# EAGLE design CubeShield (EAGLE 8.2.1)
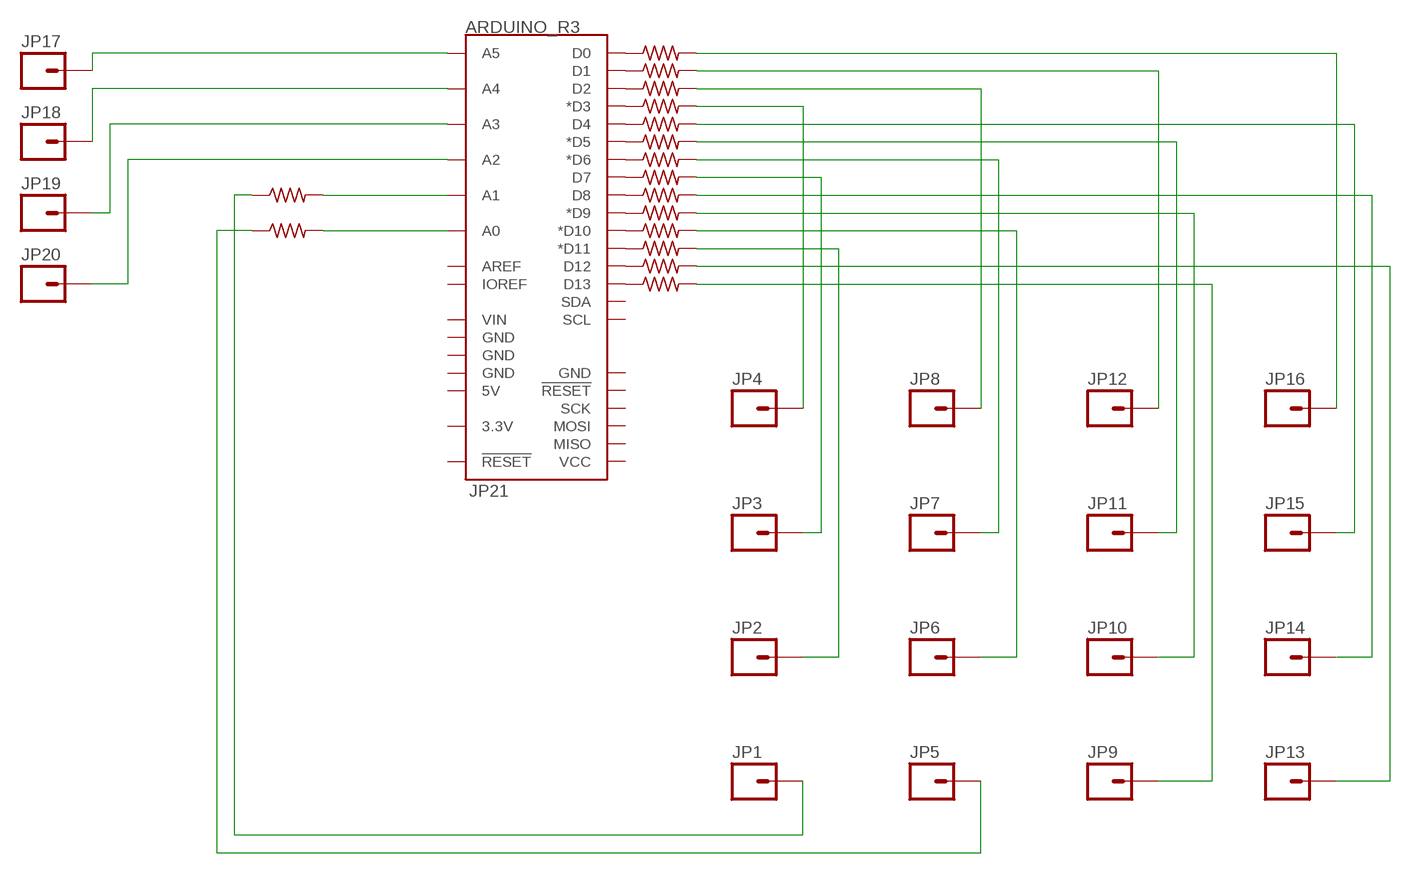
[diagram p0: schematic, sheet 1]

## Parts
JP1  M01PTH_LONGPAD  [1X01_LONGPAD]
JP2  M01PTH_LONGPAD  [1X01_LONGPAD]
JP3  M01PTH_LONGPAD  [1X01_LONGPAD]
JP4  M01PTH_LONGPAD  [1X01_LONGPAD]
JP5  M01PTH_LONGPAD  [1X01_LONGPAD]
JP6  M01PTH_LONGPAD  [1X01_LONGPAD]
JP7  M01PTH_LONGPAD  [1X01_LONGPAD]
JP8  M01PTH_LONGPAD  [1X01_LONGPAD]
JP9  M01PTH_LONGPAD  [1X01_LONGPAD]
JP10  M01PTH_LONGPAD  [1X01_LONGPAD]
JP11  M01PTH_LONGPAD  [1X01_LONGPAD]
JP12  M01PTH_LONGPAD  [1X01_LONGPAD]
JP13  M01PTH_LONGPAD  [1X01_LONGPAD]
JP14  M01PTH_LONGPAD  [1X01_LONGPAD]
JP15  M01PTH_LONGPAD  [1X01_LONGPAD]
JP16  M01PTH_LONGPAD  [1X01_LONGPAD]
JP17  M01PTH_LONGPAD  [1X01_LONGPAD]
JP18  M01PTH_LONGPAD  [1X01_LONGPAD]
JP19  M01PTH_LONGPAD  [1X01_LONGPAD]
JP20  M01PTH_LONGPAD  [1X01_LONGPAD]
JP21  ARDUINO_R3  [ARDUINO_R3]
R1  R-US_0207/7  [0207/7]
R2  R-US_0207/7  [0207/7]
R3  R-US_0207/7  [0207/7]
R4  R-US_0207/7  [0207/7]
R5  R-US_0207/7  [0207/7]
R6  R-US_0207/7  [0207/7]
R7  R-US_0207/7  [0207/7]
R8  R-US_0207/7  [0207/7]
R9  R-US_0207/7  [0207/7]
R10  R-US_0207/7  [0207/7]
R11  R-US_0207/7  [0207/7]
R12  R-US_0207/7  [0207/7]
R13  R-US_0207/7  [0207/7]
R14  R-US_0207/7  [0207/7]
R15  R-US_0207/7  [0207/7]
R16  R-US_0207/7  [0207/7]

## Nets
N$1: JP21.D0 R1.1
N$2: JP21.D1 R2.1
N$3: JP21.D2 R3.1
N$4: JP21.D3(*D3) R4.1
N$5: JP21.D4 R5.1
N$6: JP21.D5(*D5) R6.1
N$7: JP21.D6(*D6) R7.1
N$8: JP21.D7 R8.1
N$9: JP21.D8 R9.1
N$10: JP21.D9(*D9) R10.1
N$11: JP21.D10(*D10) R11.1
N$12: JP21.D11(*D11) R12.1
N$13: JP21.D12 R13.1
N$14: JP21.D13 R14.1
N$15: JP16.1 R1.2
N$16: JP12.1 R2.2
N$17: JP8.1 R3.2
N$18: JP4.1 R4.2
N$19: JP15.1 R5.2
N$20: JP11.1 R6.2
N$21: JP7.1 R7.2
N$22: JP3.1 R8.2
N$23: JP14.1 R9.2
N$24: JP10.1 R10.2
N$25: JP6.1 R11.2
N$26: JP2.1 R12.2
N$27: JP21.A0 R15.2
N$28: JP21.A1 R16.2
N$29: JP13.1 R13.2
N$30: JP9.1 R14.2
N$31: JP5.1 R15.1
N$32: JP1.1 R16.1
N$33: JP17.1 JP21.A5
N$34: JP18.1 JP21.A4
N$35: JP19.1 JP21.A3
N$36: JP20.1 JP21.A2
Unconnected: JP21.3.3V JP21.5V JP21.AREF JP21.GND@1(GND) JP21.GND@2(GND) JP21.GND@3(GND) JP21.GND@4(GND) JP21.IOREF JP21.MISO JP21.MOSI JP21.RESET@1(!RESET!) JP21.RESET@2(!RESET!) JP21.SCK JP21.SCL JP21.SDA JP21.VCC JP21.VIN

## Library data of the parts
JP1-JP20 = SparkFun-Connectors:M01: Header 1 Standard 1-pin 0.1" header. Use with straight break away headers (SKU : PRT-00116), right angle break away headers (PRT-00553), swiss pins (PRT-00743), machine pins (PRT-00117), and female headers (PRT-00115). SMTSO-256-ET is a "flush mount" nut for a 4-40 screw. The older package used to be too tight, and did not allow it to sit properly thru the drill hit. The latest (0.165DIA) fits nice and snug.
JP21 = SparkFun-Boards:ARDUINO_R3: Arduino R3 Footprint (w/ SPI header)
R1-R16 = rcl:R-US_: RESISTOR, American symbol

## Board
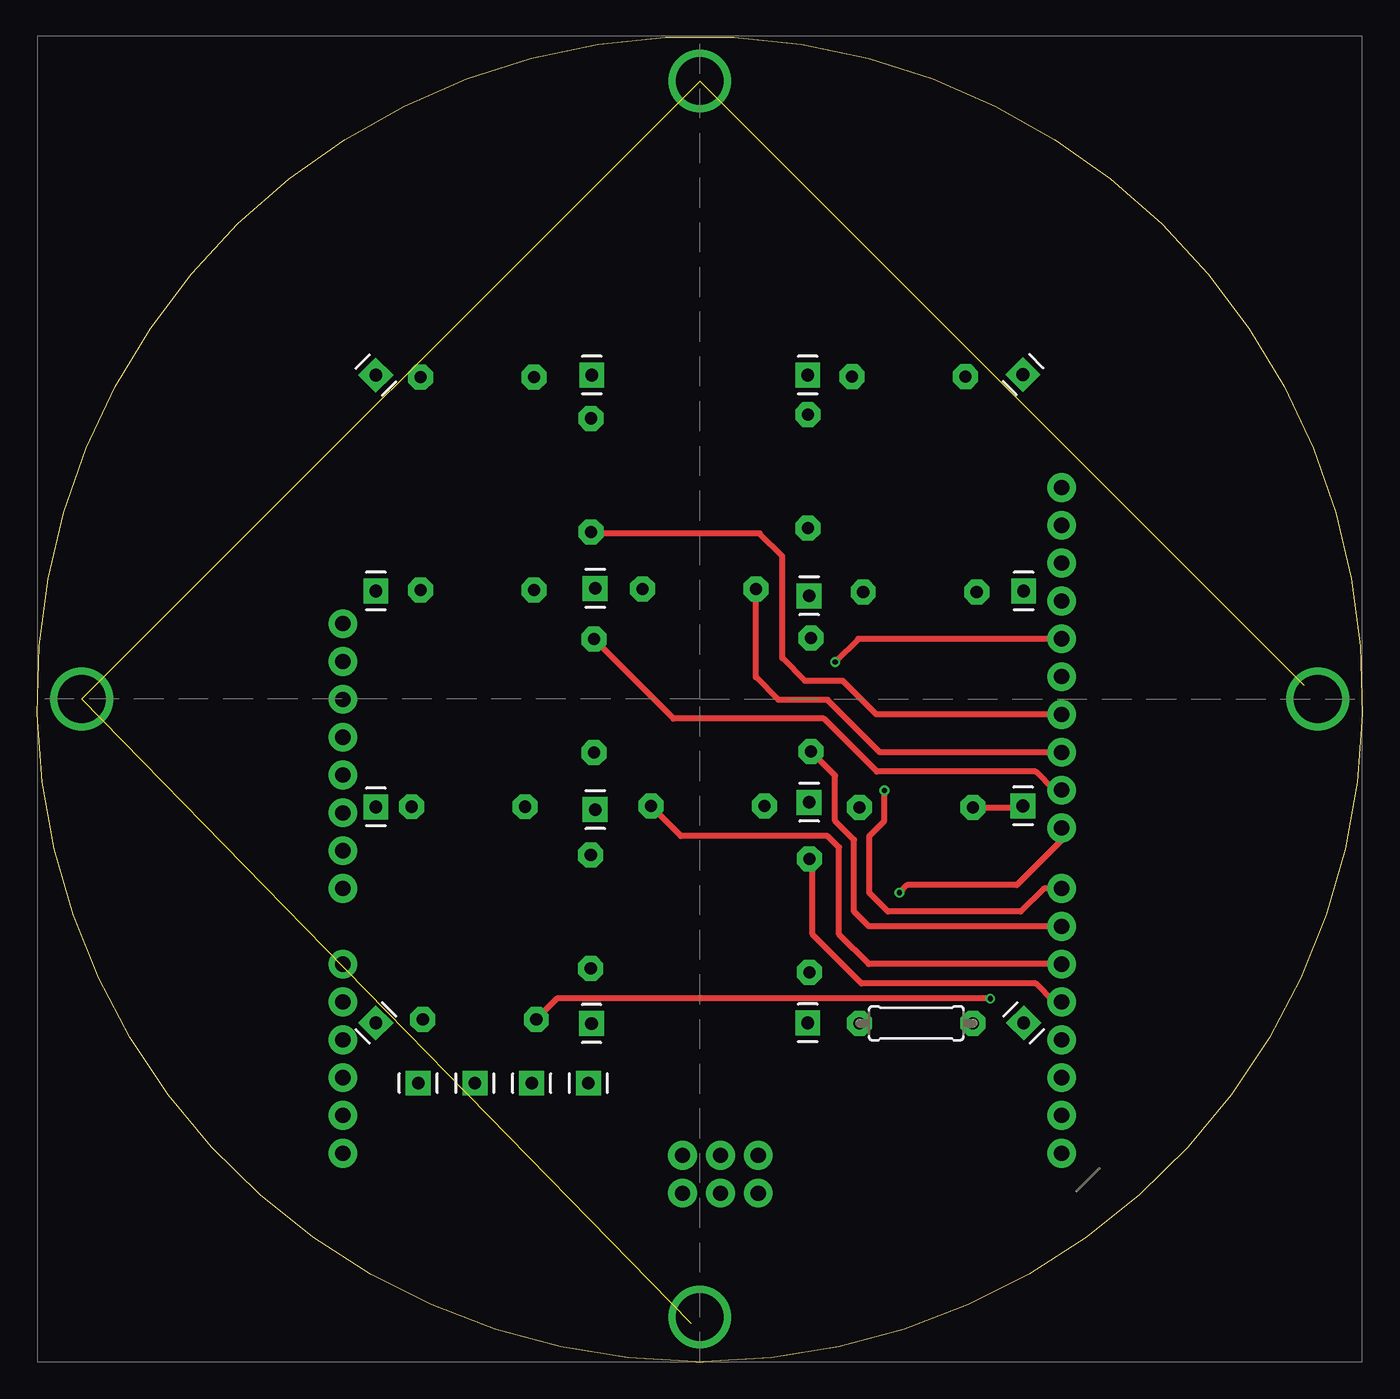
[diagram p1: board, top side]
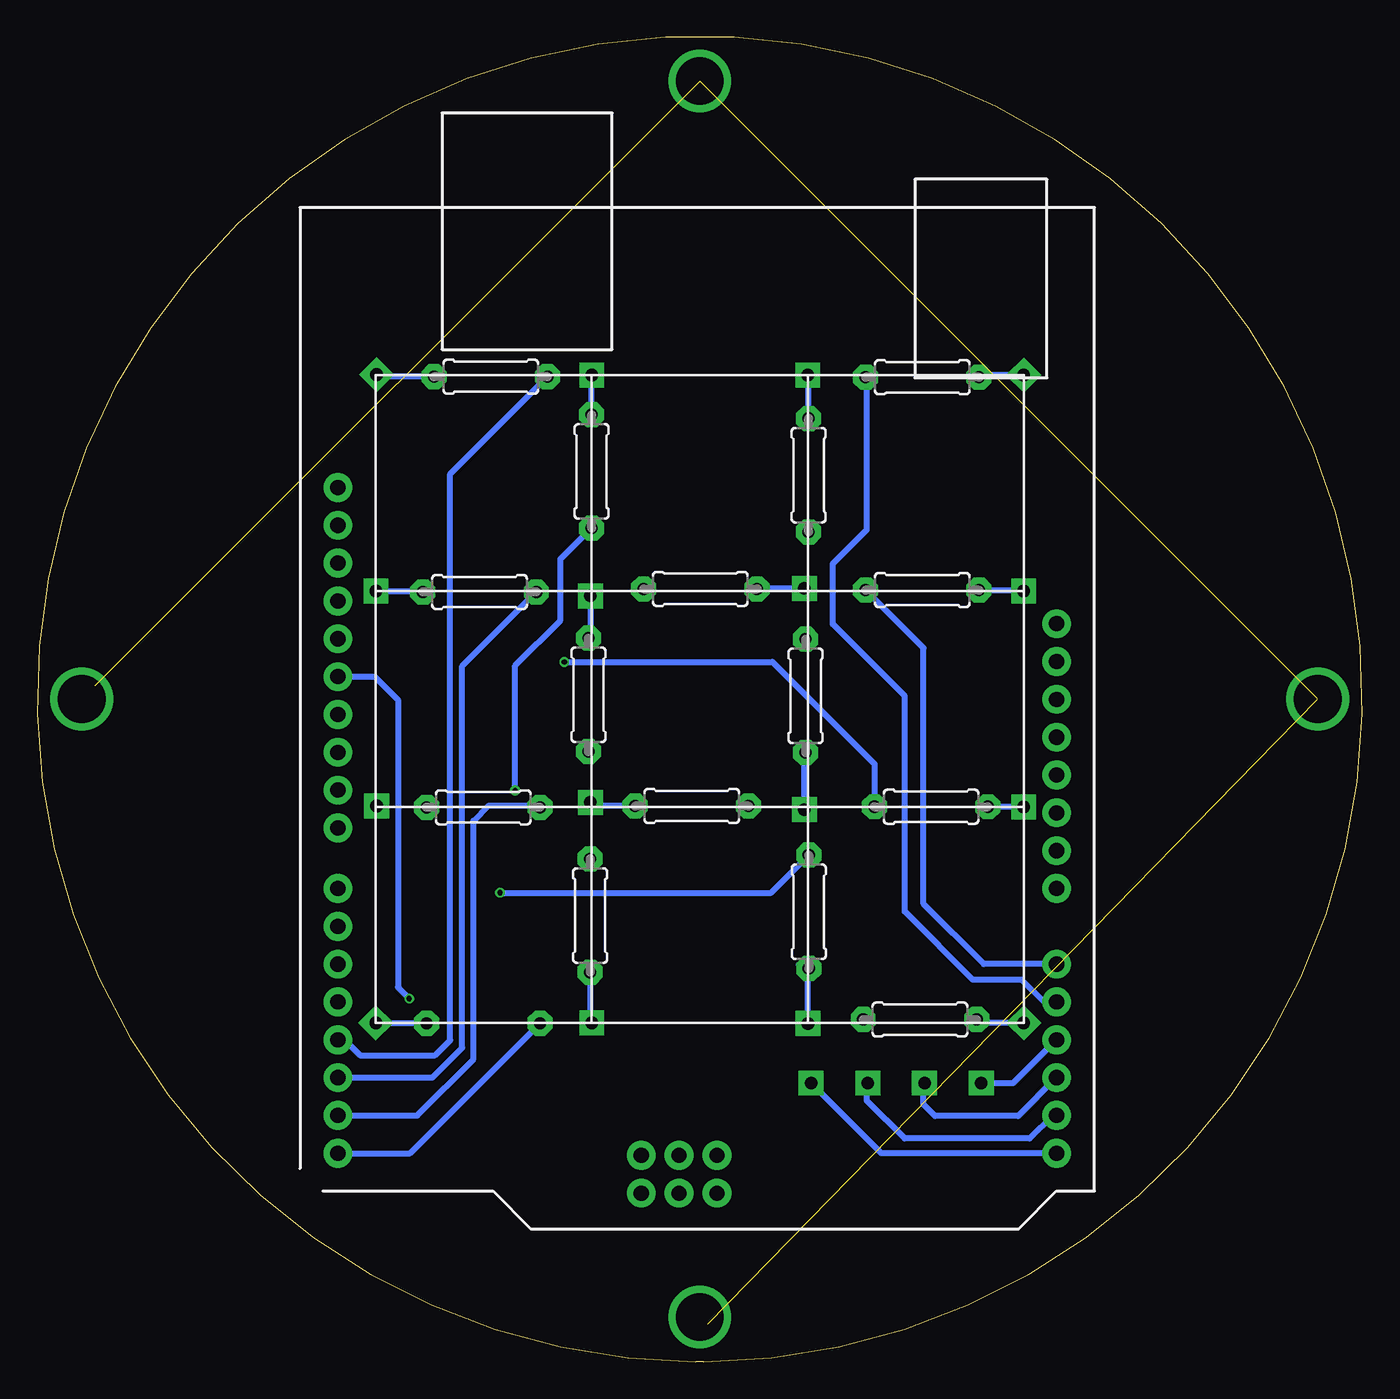
[diagram p2: board, bottom side, seen from below]

Size 88.98 x 88.94 mm. Coordinates in mm from the lower left corner, seen from the top.
Outline: 44.24,0 arc-359 44.74,0 44.24,0
Copper layers (1*16): Top 0.035mm / dielectric 1.5mm / Bottom 0.035mm
Design rules "RYSPEE_2layer_DRU": minimum track width 6mil, minimum drill 12mil, track to track 6mil, track to pad 6mil, pad to pad 6mil, via to via 6mil, smd to smd 0mil, copper to edge 10mil, drill to drill 10mil, minimum pad ring 10mil, minimum via ring 6mil, stop-mask expansion 2mil, vias tented up to drill 100mil, thermal gap 10mil

### Footprints (pad centres in the part's own frame; a part is rotated, then mirrored left to right if it is on the bottom)
1X01_LONGPAD = drill 0.85 pad 1.676 square: 1 0,0
ARDUINO_R3 = drill 1.016 pad 1.93: 3.3V 35.56,2.54; 5V 38.1,2.54; A0 50.8,2.54; A1 53.34,2.54; A2 55.88,2.54; A3 58.42,2.54; A4 60.96,2.54; A5 63.5,2.54; AREF 23.876,50.8; D0 63.5,50.8; D1 60.96,50.8; D2 58.42,50.8; D3 55.88,50.8; D4 53.34,50.8; D5 50.8,50.8; D6 48.26,50.8; D7 45.72,50.8; D8 41.656,50.8; D9 39.116,50.8; D10 36.576,50.8; D11 34.036,50.8; D12 31.496,50.8; D13 28.956,50.8; GND@1 40.64,2.54; GND@2 43.18,2.54; GND@3 26.416,50.8; GND@4 66.18,25.35; IOREF 30.48,2.54; MISO 63.64,30.43; MOSI 66.18,27.89; NC 27.94,2.54; RESET@1 33.02,2.54; RESET@2 63.64,25.35; SCK 63.64,27.89; SCL 18.796,50.8; SDA 21.336,50.8; VCC 66.18,30.43; VIN 45.72,2.54
0207/7 = drill 0.813 pad 1.676 octagon: 1 -3.81,0; 2 3.81,0

### Placement (x,y rotation side)
JP1  22.74,66.25 315 top
JP2  37.24,66.25 270 top
JP3  51.74,66.25 270 top
JP4  66.19,66.29 225 top
JP5  22.74,51.75 270 top
JP6  37.47,51.93 270 top
JP7  51.83,51.43 270 top
JP8  66.24,51.75 270 top
JP9  22.74,37.25 270 top
JP10  37.47,37.07 270 top
JP11  51.83,37.57 270 top
JP12  66.19,37.32 270 top
JP13  22.74,22.75 225 top
JP14  37.22,22.71 270 top
JP15  51.74,22.75 270 top
JP16  66.24,22.75 315 top
JP17  37.02,18.71 180 top
JP18  33.21,18.71 180 top
JP19  29.4,18.71 180 top
JP20  25.59,18.71 180 top
JP21  17.99,77.5 270 top
R1  59.03,22.73 0 top
R2  59.03,37.23 180 bottom
R3  59.28,51.69 180 bottom
R4  58.53,66.15 180 bottom
R5  51.85,29.96 270 bottom
R6  45.03,37.32 180 bottom
R7  51.96,44.79 90 bottom
R8  51.75,59.79 90 bottom
R9  37.17,30.21 270 bottom
R10  37.38,44.71 270 bottom
R11  44.45,51.9 0 bottom
R12  37.18,59.54 90 bottom
R13  29.7,22.98 0 bottom
R14  28.95,37.27 0 bottom
R15  29.55,51.82 180 bottom
R16  29.55,66.11 180 bottom

### Tracks (layer width: path | path; a pad name or v marks a point on that pad's centre or on a via)
GND  (via drill 3.2)  (3 unrouted)
  Bottom 0.406: 44.13,86.36 v44.49,86 | 85.08,45.41 v85.99,44.5 | 43.93,2.54 44.03,2.54 v44.49,3
  other vias: 2.99,44.5
N$1
  Bottom 0.406: JP21.D0 63.95,14 R1.1
N$2
  Bottom 0.406: JP21.D1 63.46,16.54 59.68,20.32 59.68,25.91 59.68,36.32 58.66,37.34 55.32,37.34 R2.1
N$3
  Bottom 0.406: JP21.D2 62.44,19.08 60.44,21.08 60.44,46.71 R3.1
N$4
  Bottom 0.406: JP21.D3 68.35,21.62 67.3,20.57 62.27,20.57 61.25,21.59 61.25,59.61 R4.1
N$5
  Top 0.406: JP21.D4 68.29,24.16 67.05,25.4 55.36,25.4 52.06,28.7 52.06,33.56 R5.1
N$6
  Top 0.406: R6.1 43.23,35.31 53.08,35.31 53.84,34.54 53.84,28.7 55.84,26.7 JP21.D5
N$7
  Top 0.406: R7.1 53.58,39.35 53.58,36.32 54.85,35.05 54.85,30.23 55.84,29.24 JP21.D6
N$8  (via drill 0.35)
  Top 0.406: JP21.D7 67.58,31.78 66.03,30.23 57.14,30.23 55.87,31.5 55.87,35.31 56.89,36.32 v56.89,38.35
  Bottom 0.406: v56.89,38.35 56.89,46.74 53.84,49.78 53.84,53.89 R8.1
N$9  (via drill 0.35)
  Top 0.406: JP21.D8 68.79,35.02 65.78,32 58.41,32 v57.9,31.5
  Bottom 0.406: v57.9,31.5 39.7,31.5 R9.1
N$10
  Top 0.406: JP21.D9 68.29,38.38 67.05,39.62 56.38,39.62 52.82,43.18 42.72,43.18 R10.1
N$11
  Top 0.406: JP21.D10 56.6,40.92 53.08,44.45 49.77,44.45 48.25,45.97 48.25,51.89 R11.1
N$12
  Top 0.406: JP21.D11 56.35,43.46 54.09,45.72 51.55,45.72 50.03,47.24 50.03,54.1 48.5,55.63 37.28,55.63 R12.1
N$13  (via drill 0.35)
  Top 0.406: v64,24.38 34.92,24.38 R13.1
  Bottom 0.406: JP21.D12 66.31,46 64.76,44.45 64.76,25.15 v64,24.38
N$14  (via drill 0.35)
  Top 0.406: JP21.D13 55.14,48.54 v53.58,46.99
  Bottom 0.406: v53.58,46.99 39.61,46.99 32.76,40.13 R14.1
N$15
  Bottom 0.406: R1.2 66.22,22.73 JP16.1
N$16
  Top 0.406: R2.2 66.1,37.23 JP12.1
N$17
  Bottom 0.406: JP8.1 63.15,51.75 R3.2
N$18
  Bottom 0.406: R4.2 66.05,66.15 JP4.1
N$19
  Bottom 0.406: R5.2 51.85,22.86 JP15.1
N$20
  Bottom 0.406: R6.2 51.58,37.32 JP11.1
N$21
  Bottom 0.406: JP7.1 51.83,48.72 R7.2
N$22
  Bottom 0.406: R8.2 JP3.1
N$23
  Bottom 0.406: JP14.1 37.22,26.06 37.84,26.67 37.44,26.67 R9.2
N$24
  Bottom 0.406: JP10.1 37.47,40.81 R10.2
N$25
  Bottom 0.406: JP6.1 40.61,51.93 R11.2
N$26
  Bottom 0.406: R12.2 37.18,66.19 JP2.1
N$27
  Bottom 0.406: JP21.A0 25.42,26.7 29.45,30.73 29.45,47.92 R15.2
N$28
  Bottom 0.406: JP21.A1 21.36,24.16 22.85,25.65 26.15,25.65 30.72,30.23 30.72,44.7 35.55,49.53 35.55,53.59 33.26,55.88 33.26,66.02 R16.2
N$29
  Bottom 0.406: JP13.1 25.66,22.75 R13.2
N$30
  Bottom 0.406: JP9.1 25.12,37.25 R14.2
N$31
  Bottom 0.406: R15.1 23.36,51.82 22.81,51.82 JP5.1
N$32
  Bottom 0.406: JP1.1 25.6,66.25 R16.1
N$33
  Bottom 0.406: JP21.A5 32.31,14 JP17.1
N$34
  Bottom 0.406: JP21.A4 20.79,16.54 22.34,14.99 30.72,14.99 33.26,17.53 33.26,18.65 JP18.1
N$35
  Bottom 0.406: JP21.A3 23.1,16.51 28.69,16.51 29.45,17.27 29.45,18.65 JP19.1
N$36
  Bottom 0.406: JP20.1 23.44,18.71 JP21.A2